# EAGLE design FootKeyboardFull (EAGLE 7.5.0)
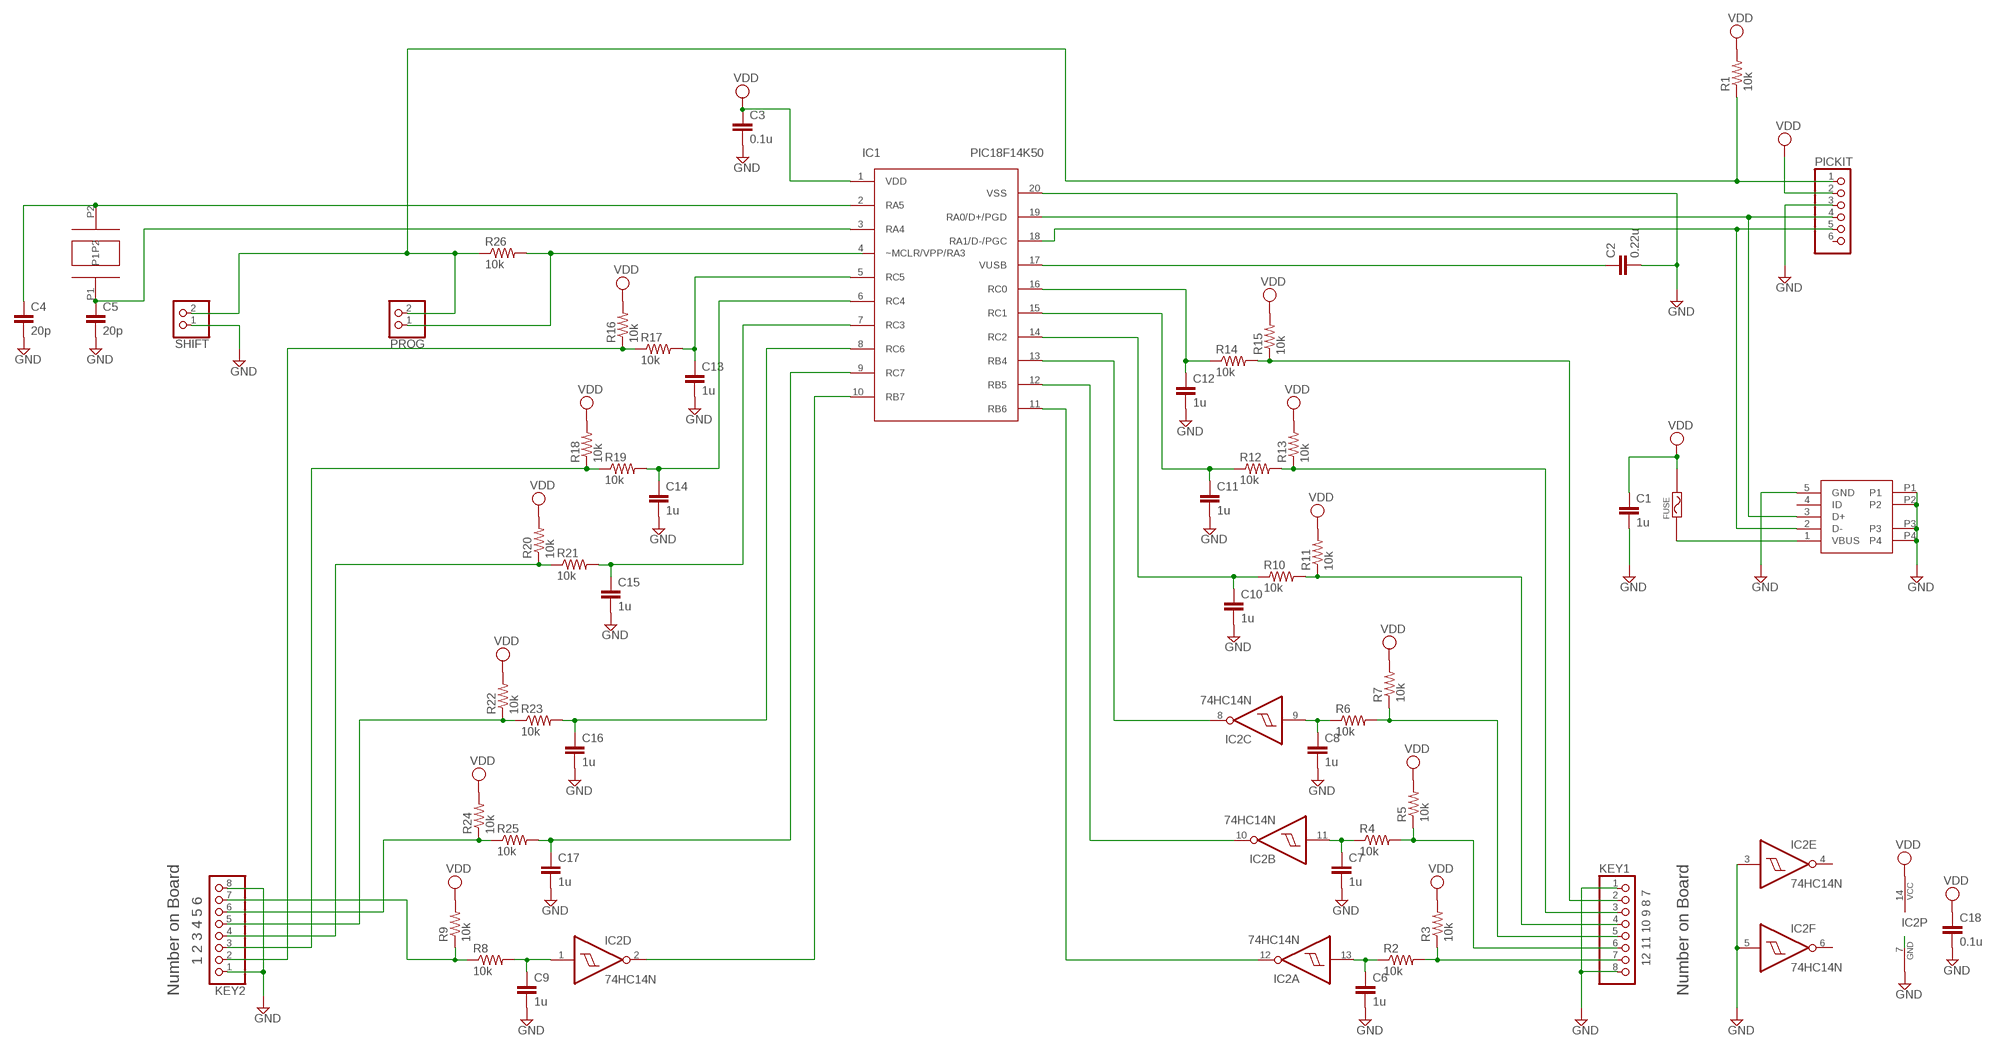
[diagram p0: schematic, sheet 1]

## Parts
C1  1u  C-EU025-025X050  [C025-025X050]
C2  0.22u  C-EU025-025X050  [C025-025X050]
C3  0.1u  C-EU025-025X050  [C025-025X050]
C4  20p  C-EU025-025X050  [C025-025X050]
C5  20p  C-EU025-025X050  [C025-025X050]
C6  1u  C-EU025-025X050  [C025-025X050]
C7  1u  C-EU025-025X050  [C025-025X050]
C8  1u  C-EU025-025X050  [C025-025X050]
C9  1u  C-EU025-025X050  [C025-025X050]
C10  1u  C-EU025-025X050  [C025-025X050]
C11  1u  C-EU025-025X050  [C025-025X050]
C12  1u  C-EU025-025X050  [C025-025X050]
C13  1u  C-EU025-025X050  [C025-025X050]
C14  1u  C-EU025-025X050  [C025-025X050]
C15  1u  C-EU025-025X050  [C025-025X050]
C16  1u  C-EU025-025X050  [C025-025X050]
C17  1u  C-EU025-025X050  [C025-025X050]
C18  0.1u  C-EU025-025X050  [C025-025X050]
FUSE  POLYSWITCH/3025  [SMD/30X25]
IC1  PIC18F14K50  PIC18F1XK50DIP  [DIL20]
IC2  74HC14N  74LS14N  [DIL14]
KEY1  PINHD-1X8  [1X08]
KEY2  PINHD-1X8  [1X08]
PICKIT  PINHD-1X6  [1X06]
PROG  PINHD-1X2  [1X02]
R1  10k  R-US_0204/7  [0204/7]
R2  10k  R-US_0204/7  [0204/7]
R3  10k  R-US_0204/7  [0204/7]
R4  10k  R-US_0204/7  [0204/7]
R5  10k  R-US_0204/7  [0204/7]
R6  10k  R-US_0204/7  [0204/7]
R7  10k  R-US_0204/7  [0204/7]
R8  10k  R-US_0204/7  [0204/7]
R9  10k  R-US_0204/7  [0204/7]
R10  10k  R-US_0204/7  [0204/7]
R11  10k  R-US_0204/7  [0204/7]
R12  10k  R-US_0204/7  [0204/7]
R13  10k  R-US_0204/7  [0204/7]
R14  10k  R-US_0204/7  [0204/7]
R15  10k  R-US_0204/7  [0204/7]
R16  10k  R-US_0204/7  [0204/7]
R17  10k  R-US_0204/7  [0204/7]
R18  10k  R-US_0204/7  [0204/7]
R19  10k  R-US_0204/7  [0204/7]
R20  10k  R-US_0204/7  [0204/7]
R21  10k  R-US_0204/7  [0204/7]
R22  10k  R-US_0204/7  [0204/7]
R23  10k  R-US_0204/7  [0204/7]
R24  10k  R-US_0204/7  [0204/7]
R25  10k  R-US_0204/7  [0204/7]
R26  10k  R-US_0204/7  [0204/7]
SHIFT  PINHD-1X2  [1X02]
USB  AKIZUKI-USB-MINI-B  [AKIZUKI-USB-MINI-B]
XTAL  12M  AKIZUKI-XTAL  [AKIZUKI-XTAL]

## Nets
GND [power]: C1.2 C2.2 C3.2 C4.2 C5.2 C6.2 C7.2 C8.2 C9.2 C10.2 C11.2 C12.2 C13.2 C14.2 C15.2 C16.2 C17.2 C18.2 IC1.20(VSS) IC2.3(E:I) IC2.5(F:I) IC2.7(P:GND) KEY1.1 KEY1.8 KEY2.1 KEY2.8 PICKIT.3 SHIFT.1 USB.5(GND) USB.P1 USB.P2 USB.P3 USB.P4
N$1: IC1.19(RA0/D+/PGD) PICKIT.4 USB.3(D+)
N$2: C5.1 IC1.3(RA4) XTAL.P1
N$3: C4.1 IC1.2(RA5) XTAL.P2
N$4: IC1.18(RA1/D-/PGC) PICKIT.5 USB.2(D-)
N$5: C6.1 IC2.13(A:I) R2.1
N$6 [power]: FUSE.P1 USB.1(VBUS)
N$7: KEY1.7 R2.2 R3.1
N$9: C2.1 IC1.17(VUSB)
N$10: C8.1 IC2.9(C:I) R6.1
N$11: C7.1 IC2.11(B:I) R4.1
N$12: KEY1.6 R4.2 R5.1
N$13: KEY1.5 R6.2 R7.1
N$14: C9.1 IC2.1(D:I) R8.2
N$15: KEY2.7 R8.1 R9.1
N$16: C10.1 IC1.14(RC2) R10.1
N$17: KEY1.4 R10.2 R11.1
N$18: C11.1 IC1.15(RC1) R12.1
N$19: KEY1.3 R12.2 R13.1
N$20: C12.1 IC1.16(RC0) R14.1
N$21: KEY1.2 R14.2 R15.1
N$22: KEY2.2 R16.1 R17.1
N$23: C13.1 IC1.5(RC5) R17.2
N$24: IC1.13(RB4) IC2.8(C:O)
N$25: IC1.12(RB5) IC2.10(B:O)
N$26: IC1.11(RB6) IC2.12(A:O)
N$27: KEY2.3 R18.1 R19.1
N$28: C14.1 IC1.6(RC4) R19.2
N$29: KEY2.4 R20.1 R21.1
N$30: C15.1 IC1.7(RC3) R21.2
N$31: KEY2.5 R22.1 R23.1
N$32: C16.1 IC1.8(RC6) R23.2
N$33: KEY2.6 R24.1 R25.1
N$34: C17.1 IC1.9(RC7) R25.2
N$35: PICKIT.1 PROG.2 R1.1 R26.1 SHIFT.2
N$37: IC1.4(~MCLR/VPP/RA3) PROG.1 R26.2
N$39: IC1.10(RB7) IC2.2(D:O)
VDD [power]: C1.1 C3.1 C18.1 FUSE.P2 IC1.1(VDD) IC2.14(P:VCC) PICKIT.2 R1.2 R3.2 R5.2 R7.2 R9.2 R11.2 R13.2 R15.2 R16.2 R18.2 R20.2 R22.2 R24.2
Unconnected: IC2.4(E:O) IC2.6(F:O) PICKIT.6 USB.4(ID)

## Notes on the sheet
- 1 2 3 4 5 6 | 12 11 10 9 8 7
- Number on Board | Number on Board

## Library data of the parts
C1-C18 = MyParts:C-EU: CAPACITOR, European symbol
FUSE = MyOriginal:POLYSWITCH/3025
IC1 = MyOriginal:PIC18F1XK50: PIC18F1XK50
IC2 = 74xx-us:74*14: Hex schmitt trigger INVERTER
KEY1 KEY2 = MyOriginal:PINHD-1X8: PIN HEADER
PICKIT = MyParts:PINHD-1X6: PIN HEADER
PROG SHIFT = MyOriginal:PINHD-1X2: PIN HEADER
R1-R26 = MyParts:R-US_: RESISTOR, American symbol
USB = MyOriginal:AKIZUKI-USB-MINI-B
XTAL = MyOriginal:AKIZUKI-XTAL

## Net classes
0 default: width 0.152 mm, clearance 0.203 mm
1 power: width 0.305 mm, clearance 0.203 mm

## Board
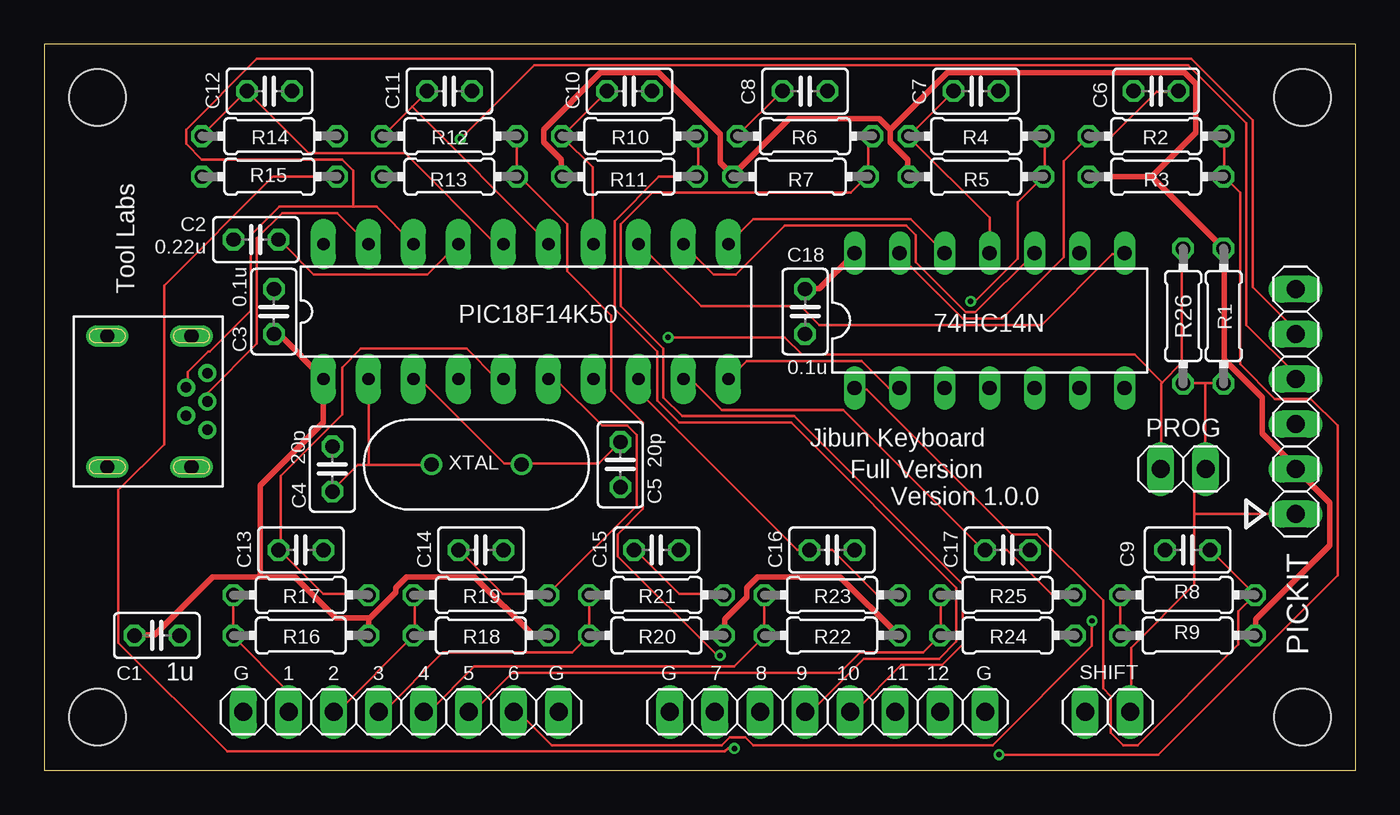
[diagram p1: board, top side]
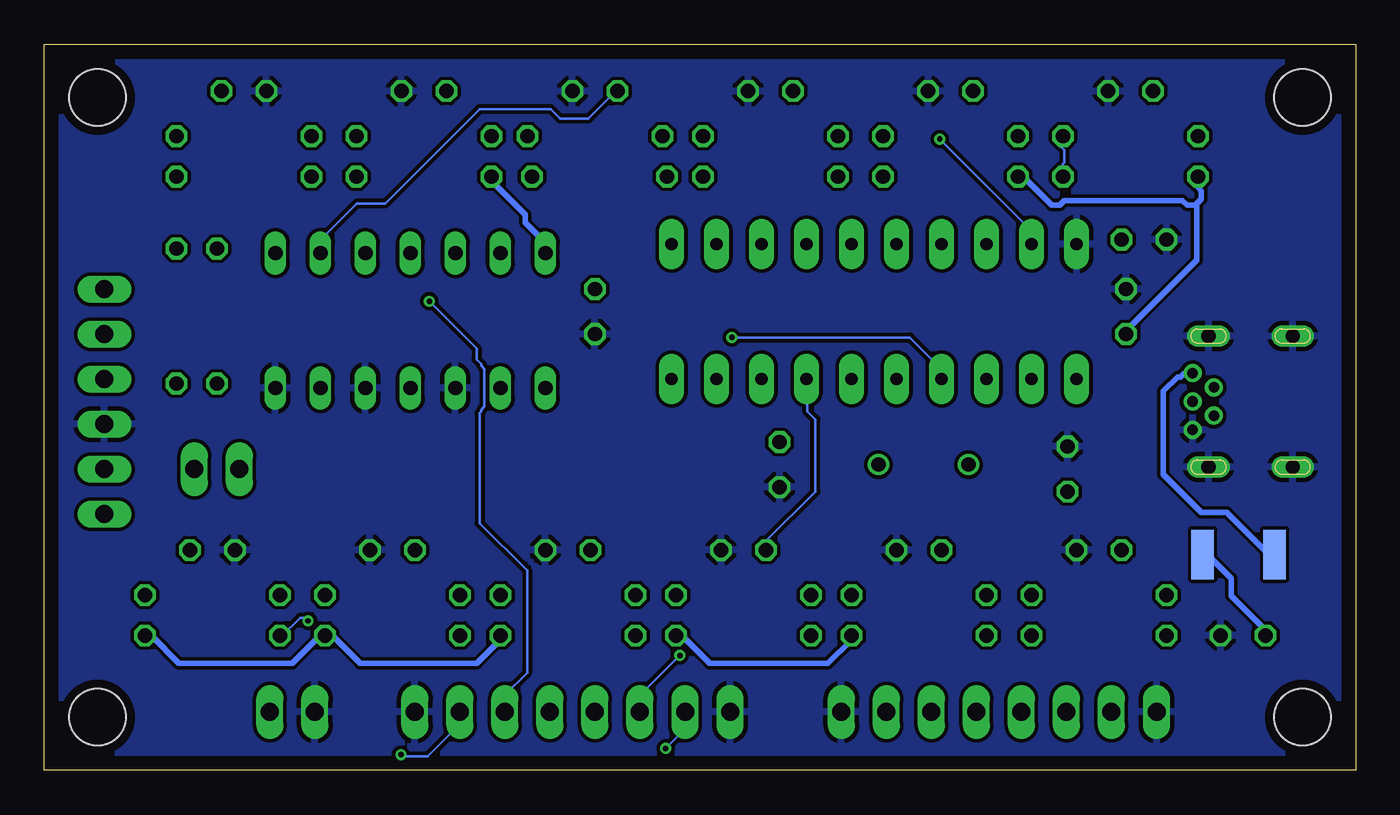
[diagram p2: board, bottom side, seen from below]

Size 74 x 41 mm. Coordinates in mm from the lower left corner, seen from the top.
Outline: 0,0 74,0 74,41 0,41 0,0
Copper layers (1*16): Top 0.035mm / dielectric 1.6mm / Bottom 0.035mm
Design rules "Elecrow_2-layer_PCB_eagle_rule": minimum track width 6mil, minimum drill 12mil, track to track 6mil, track to pad 6mil, pad to pad 6mil, via to via 8mil, smd to smd 0mil, copper to edge 20mil, drill to drill 10mil, minimum pad ring 6mil, minimum via ring 6mil, stop-mask expansion 0mil, vias tented up to drill 100mil, thermal gap 10mil
Holes 3.2 mm at 3,38 3,3 71,3 71,38

### Footprints (pad centres in the part's own frame; a part is rotated, then mirrored left to right if it is on the bottom)
C025-025X050 = drill 0.813 octagon: 1 -1.27,0; 2 1.27,0
SMD/30X25 = smd 1.27 x 2.794: P1 -2.032,0; P2 2.032,0
DIL20 = drill 0.7 pad 1.422 long: 1 -10.16,-3.81; 2 -7.62,-3.81; 3 -5.08,-3.81; 4 -2.54,-3.81; 5 0,-3.81; 6 2.54,-3.81; 7 5.08,-3.81; 8 7.62,-3.81; 9 10.16,-3.81; 10 12.7,-3.81; 11 12.7,3.81; 12 10.16,3.81; 13 7.62,3.81; 14 5.08,3.81; 15 2.54,3.81; 16 0,3.81; 17 -2.54,3.81; 18 -5.08,3.81; 19 -7.62,3.81; 20 -10.16,3.81
DIL14 = drill 0.813 long: 1 -7.62,-3.81; 2 -5.08,-3.81; 3 -2.54,-3.81; 4 0,-3.81; 5 2.54,-3.81; 6 5.08,-3.81; 7 7.62,-3.81; 8 7.62,3.81; 9 5.08,3.81; 10 2.54,3.81; 11 0,3.81; 12 -2.54,3.81; 13 -5.08,3.81; 14 -7.62,3.81
1X08 = drill 1.016 long: 1 -8.89,0; 2 -6.35,0; 3 -3.81,0; 4 -1.27,0; 5 1.27,0; 6 3.81,0; 7 6.35,0; 8 8.89,0
1X06 = drill 1.016 long: 1 -6.35,0; 2 -3.81,0; 3 -1.27,0; 4 1.27,0; 5 3.81,0; 6 6.35,0
1X02 = drill 1.016 long: 1 -1.27,0; 2 1.27,0
0204/7 = drill 0.813 octagon: 1 -3.81,0; 2 3.81,0
AKIZUKI-USB-MINI-B = drill 0.6 pad 1.016: 1 -1.6,5.65; 2 -0.8,4.45; 3 0,5.65; 4 0.8,4.45; 5 1.6,5.65 | drill 0.8 long: P1 -3.7,4.75; P2 -3.7,0; P3 3.7,0; P4 3.7,4.75
AKIZUKI-XTAL = drill 0.8: P1 -2.54,0; P2 2.54,0

### Placement (x,y rotation side)
C1  6.35,7.62 0 top
C2  11.94,29.97 180 top
C3  12.95,25.91 90 top
C4  16.26,17.02 90 top
C5  32.51,17.27 270 top
C6  62.74,38.35 180 top
C7  52.58,38.35 0 top
C8  42.93,38.35 0 top
C9  64.52,12.45 180 top
C10  33.02,38.35 0 top
C11  22.86,38.35 0 top
C12  12.7,38.35 0 top
C13  14.48,12.45 0 top
C14  24.64,12.45 0 top
C15  34.54,12.45 0 top
C16  44.45,12.45 0 top
C17  54.36,12.45 0 top
C18  42.93,25.91 270 top
FUSE  6.6,12.19 180 bottom
IC1  25.91,25.91 0 top
IC2  53.34,25.4 0 top
KEY1  44.2,3.3 0 top
KEY2  20.13,3.3 0 top
PICKIT  70.61,20.83 90 top
PROG  64.26,17.02 0 top
R1  66.55,25.65 90 top
R2  62.74,35.81 0 top
R3  62.74,33.53 180 top
R4  52.58,35.81 0 top
R5  52.58,33.53 180 top
R6  42.93,35.81 0 top
R7  42.67,33.53 180 top
R8  64.52,9.91 0 top
R9  64.52,7.62 0 top
R10  33.02,35.81 0 top
R11  33.02,33.53 180 top
R12  22.86,35.81 0 top
R13  22.86,33.53 180 top
R14  12.7,35.81 0 top
R15  12.7,33.53 180 top
R16  14.48,7.62 0 top
R17  14.48,9.91 0 top
R18  24.64,7.62 0 top
R19  24.64,9.91 0 top
R20  34.54,7.62 0 top
R21  34.54,9.91 0 top
R22  44.45,7.62 0 top
R23  44.45,9.91 0 top
R24  54.36,7.62 0 top
R25  54.36,9.91 0 top
R26  64.26,25.65 90 top
SHIFT  60.01,3.3 0 top
USB  3.56,20.83 270 top
XTAL  24.38,17.27 180 top

### Tracks (layer width: path | path; a pad name or v marks a point on that pad's centre or on a via)
GND
  pour Bottom: 1,1 73,1 73,40 1,40
N$1  (via drill 0.3)
  Top 0.152: IC1.19 16.54,31.47 13.42,31.47 12,30.05 12,24.09 9.25,21.34 9.25,20.89 USB.3 | v23.47,35.65 27.65,39.83 64.54,39.83 67.83,36.54 67.83,25.16 70.59,22.4 70.59,22.14 PICKIT.4
  Bottom 0.152: v23.47,35.65 18.31,30.49 18.31,29.78 IC1.19
N$2
  Top 0.152: C5.1 32.45,18.49 31.29,17.34 26.94,17.34 XTAL.P1 26.85,17.34 25.96,17.34 21.25,22.05 20.89,22.05 IC1.3
N$3
  Top 0.152: 18.31,17.25 17.69,17.25 16.27,15.82 C4.1 | 18.31,17.25 21.78,17.25 XTAL.P2 | 18.31,17.25 18.31,22.05 IC1.2
N$4
  Top 0.152: 17.42,31.83 18.76,31.83 20.8,29.78 IC1.18 | 17.42,31.83 13.25,31.83 11.65,30.23 11.65,25.96 9.34,23.65 9.25,23.65 8.09,22.49 8.09,21.69 USB.2 | 17.42,31.83 17.42,33.87 16.8,34.49 8.89,34.49 8,35.38 8,36.18 12,40.18 64.72,40.18 68.19,36.72 68.19,27.29 70.59,24.89 70.59,24.71 PICKIT.5
N$5
  Top 0.152: IC2.13 48.27,29.16 48.81,28.63 48.81,28.54 51.83,25.51 54.05,25.51 57.52,28.98 57.52,34.4 R2.1 58.94,35.83 60.27,35.83 62.76,38.32 64.01,38.32 C6.1
N$6
  Bottom 0.305: USB.1 9.25,22.4 9.69,22.4 9.87,22.23 10.05,22.23 10.85,21.43 10.85,16.71 8.71,14.58 7.29,14.58 4.98,12.27 4.62,12.27 FUSE.P1
N$7  (via drill 0.3)
  Top 0.152: R2.2 66.59,35.74 66.59,33.6 R3.1 66.59,33.52 67.47,32.63 67.47,22.94 69.43,20.98 71.48,20.98 72.99,19.47 72.99,11.02 62.85,0.89 v53.87,0.89
  Bottom 0.152: v53.87,0.89 53.78,0.8 52.36,0.8 50.58,2.58 50.58,3.29 KEY1.7
N$9
  Top 0.152: C2.1 13.25,29.96 15.2,28 21.6,28 23.29,29.69 IC1.17
N$10
  Top 0.152: R6.1 39.12,35.83 41.6,38.32 C8.1
  Bottom 0.152: IC2.9 58.41,29.25 58.41,29.96 56.36,32 54.76,32 49.43,37.34 45.43,37.34 44.9,36.8 43.29,36.8 41.69,38.41 C8.1
N$11
  Top 0.152: C7.1 51.3,38.32 48.81,35.83 R4.1 48.81,35.74 53.34,31.2 IC2.11
N$12  (via drill 0.3)
  Top 0.152: R4.2 56.45,35.74 56.45,33.6 R5.1 56.36,33.52 54.94,32.09 54.94,28.89 52.54,26.49 v52.27,26.49
  Bottom 0.152: KEY1.6 48.01,4.27 46.76,5.51 46.76,11.29 49.43,13.96 49.43,20.18 49.34,20.27 49.34,20.36 49.16,20.54 49.16,22.67 49.34,22.85 49.34,22.94 49.61,23.2 49.61,23.82 v52.27,26.49
N$13
  Top 0.152: R6.2 46.67,35.74 46.49,35.56 46.49,33.6 R7.1 46.41,33.52 45.52,32.63 34.31,32.63 32.54,30.85 32.54,26.23 34.94,23.82 34.94,21.07 36.01,20 42.32,20 51.83,10.49 51.83,7.11 50.67,5.96 48.36,5.96 45.78,3.38 45.52,3.38 KEY1.5
N$14
  Top 0.152: C9.1 R8.2 68.28,9.87 67.39,8.98 67.39,7.11 61.7,1.42 60.9,1.42 60.19,2.13 60.19,4.18 59.74,4.62 59.74,9.6 56.01,13.34 54.59,13.34 46.41,21.51 45.78,21.51 IC2.1
N$15  (via drill 0.3)
  Top 0.152: R9.1 60.72,7.64 60.72,9.87 R8.1 | v59.12,8.45 59.12,7.02 53.52,1.42 40.01,1.42 39.56,1.87 38.67,1.87 38.23,1.42 28.63,1.42 26.76,3.29 26.49,3.29 KEY2.7
  Bottom 0.152: v59.12,8.45 59.3,8.62 59.56,8.62 60.63,7.56 R9.1
N$16
  Top 0.152: C10.1 31.74,38.32 29.25,35.83 R10.1 29.25,35.74 30.94,34.05 30.94,29.78 IC1.14
N$17
  Top 0.152: R10.2 36.89,35.74 36.89,33.6 R11.1 36.8,33.52 34.67,33.52 32.18,31.03 32.18,26.05 34.58,23.65 34.58,20.89 35.83,19.65 42.14,19.65 51.47,10.31 51.47,7.29 50.49,6.31 46.23,6.31 43.29,3.38 42.94,3.38 KEY1.4
N$18
  Top 0.152: 20.76,37.47 21.6,38.32 C11.1 | 20.76,37.47 19.11,35.83 R12.1 | 20.76,37.47 28.45,29.78 IC1.15
N$19  (via drill 0.3)
  Top 0.152: R12.2 26.67,33.69 | 26.67,33.69 R13.1 26.67,33.6 | v38.14,6.49 37.96,6.49 32.36,12.09 32.36,13.34 33.78,14.76 33.78,19.65 32,21.43 32,25.69 29.52,28.18 29.52,30.85 26.67,33.69
  Bottom 0.152: v38.14,6.49 40.36,4.27 40.36,3.38 KEY1.3
N$20
  Top 0.152: R14.1 8.89,35.83 11.38,38.32 C12.1 14.94,34.85 20.36,34.85 25.43,29.78 25.87,29.78 IC1.16
N$21  (via drill 0.3)
  Top 0.152: v38.94,1.25 38.58,1.25 38.41,1.07 10.31,1.07 4.18,7.2 4.18,15.82 6.76,18.4 6.76,27.38 12.89,33.52 16.45,33.52 R15.1
  Bottom 0.152: R15.1 16.54,33.6 16.54,34.23 16.45,34.31 16.45,35.03 16.62,35.2 16.62,35.65 16.54,35.74 R14.2 | v38.94,1.25 37.87,2.31 37.87,3.29 KEY1.2
N$22
  Top 0.152: R17.1 R16.1 10.67,7.56 13.78,4.45 13.78,3.38 KEY2.2
N$23
  Top 0.152: R17.2 18.22,9.96 15.73,9.96 13.25,12.45 C13.1 13.34,12.45 13.34,16.62 16.8,20.09 16.8,22.76 17.87,23.82 23.82,23.82 25.51,22.14 25.87,22.14 IC1.5
N$24
  Top 0.152: IC2.8 60.9,29.16 60.27,29.16 56.27,25.16 43.74,25.16 42.67,26.23 37.07,26.23 33.6,29.69 IC1.13
N$25
  Top 0.152: IC2.10 52.54,25.87 52.01,25.87 49.16,28.71 49.16,30.23 48.63,30.76 41.78,30.76 39.03,28 37.78,28 IC1.12
N$26
  Top 0.152: IC2.12 48.9,31.11 40.01,31.11 IC1.11
N$27
  Top 0.152: R19.1 20.89,9.87 20.89,7.64 R18.1 20.8,7.56 16.62,3.38 16.36,3.38 KEY2.3
N$28
  Top 0.152: 28.45,9.96 25.87,9.96 23.38,12.45 C14.1 | 28.45,9.96 33.43,14.94 33.43,18.94 32.89,19.47 31.47,19.47 28.89,22.05 28.45,22.05 IC1.6 | 28.45,9.96 R19.2
N$29
  Top 0.152: R21.1 30.76,9.87 30.76,7.64 R20.1 29.78,6.67 22.49,6.67 19.2,3.38 18.94,3.38 KEY2.4
N$30
  Top 0.152: R21.2 38.32,9.96 35.83,9.96 33.34,12.45 C15.1
  Bottom 0.152: IC1.7 30.94,22.05 30.94,20.27 30.49,19.82 30.49,15.73 33.25,12.98 33.25,12.45 C15.1
N$31
  Top 0.152: R23.1 40.63,9.87 40.63,7.64 R22.1 40.63,7.56 38.94,5.87 24.27,5.87 21.78,3.38 21.43,3.38 KEY2.5
N$32
  Top 0.152: R23.2 48.18,9.96 46.94,9.96 44.45,12.45 C16.1 42.49,12.45 33.6,21.34 33.6,22.05 IC1.8
N$33
  Top 0.152: R25.1 50.58,9.87 50.58,7.64 R24.1 50.49,7.56 49.61,6.67 46.05,6.67 44.9,5.51 26.4,5.51 24.27,3.38 24,3.38 KEY2.6
N$34
  Top 0.152: R25.2 58.14,9.96 56.81,9.96 54.32,12.45 C17.1 52.98,12.45 45.07,20.36 38.23,20.36 36.54,22.05 36.09,22.05 IC1.9
N$35
  Top 0.152: 65.52,21.87 66.5,21.87 R1.1 | 65.52,21.87 64.28,21.87 R26.1 | 64.9,14.49 64.9,16.36 65.52,16.98 PROG.2 65.52,17.07 65.52,21.87 | 64.9,14.49 64.9,10.49 61.34,6.93 61.34,3.38 SHIFT.2 | 64.9,14.49 70.59,14.49 PICKIT.1
N$37  (via drill 0.3)
  Top 0.152: 63.08,21.91 63.03,21.87 63.03,17.07 PROG.1 | 63.08,21.91 64.19,23.02 64.19,29.43 R26.2 | v35.2,24.45 41.78,24.45 42.76,23.47 61.52,23.47 63.08,21.91
  Bottom 0.152: v35.2,24.45 25.16,24.45 23.38,22.67 23.38,22.14 IC1.4
N$39
  Top 0.152: IC2.2 48.18,21.6 47.65,21.6 46.14,23.11 39.65,23.11 38.67,22.14 IC1.10
VDD
  Top 0.305: C18.1 42.94,27.2 43.74,27.2 45.7,29.16 IC2.14 | R11.2 29.16,33.6 29.16,34.49 28.18,35.47 28.18,36.18 31.38,39.38 34.67,39.38 38.14,35.92 38.14,34.31 38.85,33.6 R7.2 38.94,33.69 42.05,36.8 47.12,36.8 47.74,36.18 | 47.74,36.18 47.74,35.47 48.72,34.49 48.72,33.6 R5.2 | 62.5,33.52 58.94,33.52 R3.2 | 62.5,33.52 R1.2 66.59,29.34 66.59,23.2 68.72,21.07 68.72,19.02 70.59,17.16 PICKIT.2 70.67,16.98 72.54,15.11 72.54,12.71 68.36,8.53 68.36,7.64 R9.2 | 47.74,36.18 50.94,39.38 64.36,39.38 64.99,38.76 64.99,36.01 62.5,33.52 | C3.1 12.98,24.62 13.25,24.62 15.73,22.14 IC1.1 15.73,21.96 15.73,19.65 12.18,16.09 12.18,10.94 | R20.2 38.41,7.64 38.41,8.53 39.65,9.78 39.65,10.31 40.27,10.94 44.9,10.94 48.18,7.64 R22.2 | 18.31,8.53 18.31,7.64 R16.2 | 18.31,8.53 19.82,10.05 19.82,10.31 20.45,10.94 24.27,10.94 27.56,7.64 28.45,7.64 R18.2 | 12.18,10.94 14.13,10.94 16.45,8.62 18.22,8.62 18.31,8.53 | 12.18,10.94 9.51,10.94 6.22,7.64 5.16,7.64 C1.1
  Bottom 0.305: R5.2 48.72,33.52 48.72,33.25 46.85,31.38 46.85,30.94 45.78,29.87 45.78,29.25 IC2.14 | R15.2 8.89,32.89 8.71,32.72 8.71,32.27 8.98,32 | 8.98,32 8.98,28.8 12.89,24.89 12.89,24.71 C3.1 | R13.2 19.02,33.52 18.76,33.52 17.16,31.91 16.71,31.91 16.45,32.18 9.78,32.18 9.51,31.91 9.07,31.91 8.98,32 | R22.2 48.27,7.56 48.27,7.38 49.61,6.04 56.19,6.04 57.7,7.56 58.14,7.56 R24.2 58.32,7.64 58.41,7.64 60.01,6.04 66.41,6.04 67.92,7.56 68.28,7.56 R9.2 | C1.1 5.16,7.64 5.16,8 7.02,9.87 7.02,10.85 8.36,12.18 8.62,12.18 FUSE.P2 | R18.2 28.45,7.38 29.78,6.04 36.45,6.04 37.96,7.56 38.32,7.56 R20.2

### Text on the board
tPlace: Tool Labs | Jibun Keyboard | Full Version | Version 1.0.0 | 1u | G | 1 | 2 | 3 | 4 | 5 | 6 | G | G | 7 | 8 | 9 | 10 | 11 | 12 | G